# EAGLE design Onion_PCIe_Eval (EAGLE 9.6.2)
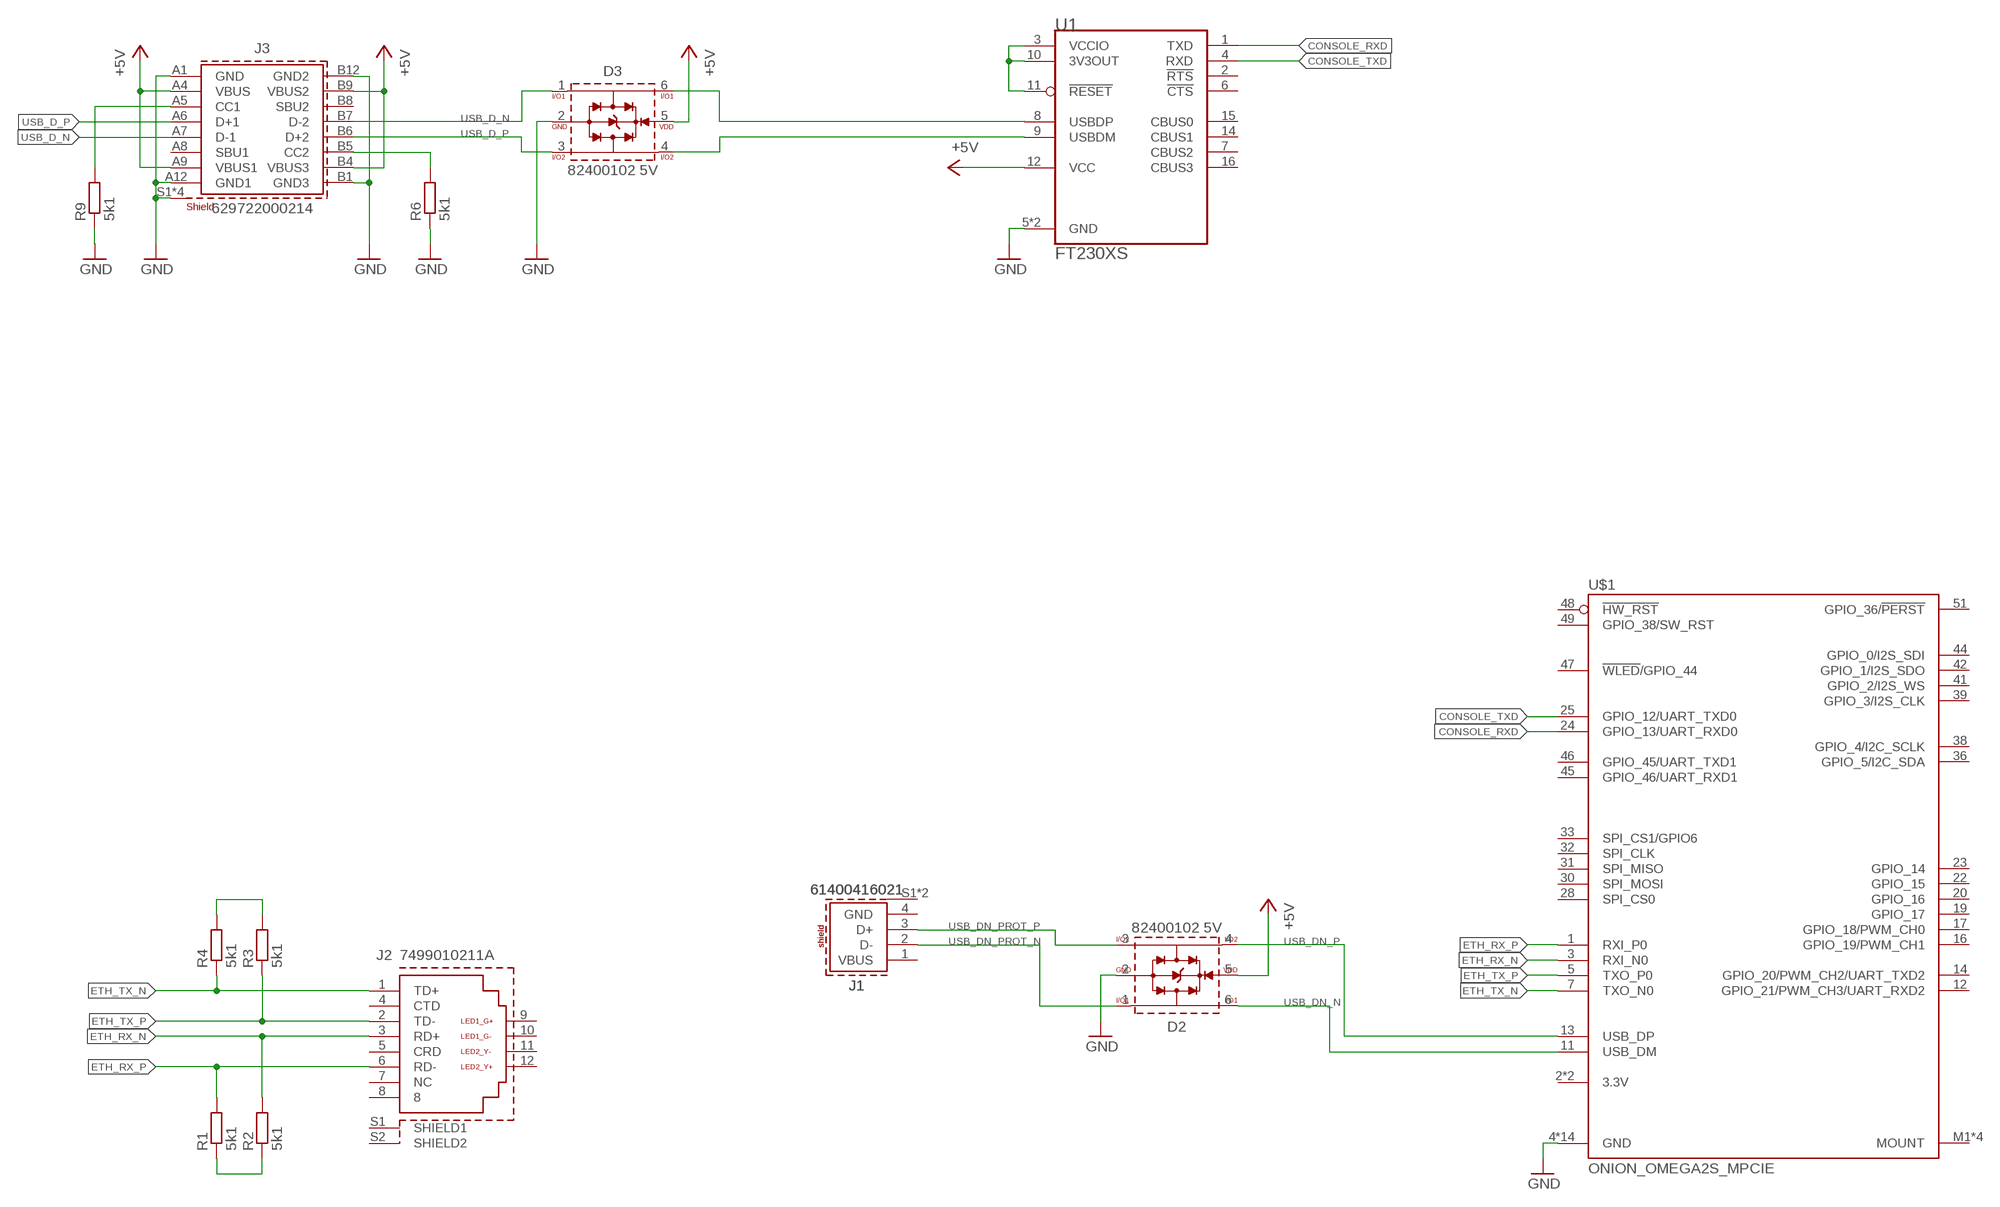
[diagram p0: schematic, sheet 1]

## Parts
D2  82400102 5V  WE-TVS-HS_SOT23-6L_82400102  [WE-TVS_SOT23-6L]
D3  82400102 5V  WE-TVS-HS_SOT23-6L_82400102  [WE-TVS_SOT23-6L]
J1  61400416021  61400416021  [61400416021]
J2  7499010211A  WE-RJ45_7499010211A  [7499010211A]
J3  629722000214  [629722000214]
R1  5k1  R-EU_R0603  [R0603]
R2  5k1  R-EU_R0603  [R0603]
R3  5k1  R-EU_R0603  [R0603]
R4  5k1  R-EU_R0603  [R0603]
R6  5k1  R-EU_R0603  [R0603]
R9  5k1  R-EU_R0603  [R0603]
U1  FT230XS  [SSOP-16_FTD]
U$1  ONION_OMEGA2S_MPCIE  [MINI_PCIE_CONNECTOR_5.2H]

## Nets
+5V: D2.5(VDD) D3.5(VDD) J3.A4(VBUS) J3.A9(VBUS1) J3.B4(VBUS3) J3.B9(VBUS2) U1.12(VCC)
CONSOLE_RXD: U1.1(TXD) U$1.24(GPIO_13/UART_RXD0)
CONSOLE_TXD: U1.4(RXD) U$1.25(GPIO_12/UART_TXD0)
ETH_RX_N: J2.3(RD+) R2.2 U$1.3(RXI_N0)
ETH_RX_P: J2.6(RD-) R1.2 U$1.1(RXI_P0)
ETH_TX_N: J2.1(TD+) R4.1 U$1.7(TXO_N0)
ETH_TX_P: J2.2(TD-) R3.1 U$1.5(TXO_P0)
GND: D2.2(GND) D3.2(GND) J3.A1(GND) J3.A12(GND1) J3.B1(GND3) J3.B12(GND2) J3.S1(SHIELD) J3.S2(SHIELD) J3.S3(SHIELD) J3.S4(SHIELD) R6.1 R9.1 U1.5(GND) U1.13(GND) U$1.4(GND) U$1.9(GND) U$1.15(GND) U$1.18(GND) U$1.21(GND) U$1.26(GND) U$1.27(GND) U$1.29(GND) U$1.34(GND) U$1.35(GND) U$1.37(GND) U$1.40(GND) U$1.43(GND) U$1.50(GND)
N$1: R1.1 R2.1
N$2: J3.A5(CC1) R9.2
N$3: R3.2 R4.2
N$4: U1.3(VCCIO) U1.10(3V3OUT) U1.11(!RESET)
N$5: J3.B5(CC2) R6.2
USB_D_N [USB]: D3.1(I/O1) J3.A7(D-1) J3.B7(D-2)
USB_D_P [USB]: D3.3(I/O2) J3.A6(D+1) J3.B6(D+2)
USB_D_PROT_N [USB]: D3.6(I/O3) U1.8(USBDP)
USB_D_PROT_P [USB]: D3.4(I/O4) U1.9(USBDM)
USB_DN_N: D2.6(I/O3) U$1.11(USB_DM)
USB_DN_P: D2.4(I/O4) U$1.13(USB_DP)
USB_DN_PROT_N: D2.1(I/O1) J1.2(D-)
USB_DN_PROT_P [USB]: D2.3(I/O2) J1.3(D+)
Unconnected: J1.1(VBUS) J1.4(GND) J1.S1(SHIELD) J1.S2(SHIELD) J2.4(CTD) J2.5(CRD) J2.7(NC) J2.8 J2.9(LED1_G+) J2.10(LED1_G-) J2.11(LED2_Y-) J2.12(LED2_Y+) J2.S1(SHIELD1) J2.S2(SHIELD2) J3.A8(SBU1) J3.B8(SBU2) U1.2(!RTS) U1.6(!CTS) U1.7(CBUS2) U1.14(CBUS1) U1.15(CBUS0) U1.16(CBUS3) U$1.2(3.3V) U$1.12(GPIO_21/PWM_CH3/UART_RXD2) U$1.14(GPIO_20/PWM_CH2/UART_TXD2) U$1.16(GPIO_19/PWM_CH1) U$1.17(GPIO_18/PWM_CH0) U$1.19(GPIO_17) U$1.20(GPIO_16) U$1.22(GPIO_15) U$1.23(GPIO_14) U$1.28(SPI_CS0) U$1.30(SPI_MOSI) U$1.31(SPI_MISO) U$1.32(SPI_CLK) U$1.33(SPI_CS1/GPIO6) U$1.36(GPIO_5/I2C_SDA) U$1.38(GPIO_4/I2C_SCLK) U$1.39(GPIO_3/I2S_CLK) U$1.41(GPIO_2/I2S_WS) U$1.42(GPIO_1/I2S_SDO) U$1.44(GPIO_0/I2S_SDI) U$1.45(GPIO_46/UART_RXD1) U$1.46(GPIO_45/UART_TXD1) U$1.47(!WLED!/GPIO_44) U$1.48(!HW_RST) U$1.49(GPIO_38/SW_RST) U$1.51(GPIO_36/!PERST) U$1.52(3.3V) U$1.M1(MOUNT) U$1.M2(MOUNT) U$1.M3(MOUNT) U$1.M4(MOUNT)

## Library data of the parts
D2 D3 = Wurth_EMC Components_WE-TVS:WE-TVS-HS_SOT23-6L_82400102: WE-TVS TVS Diode – High Speed Series Characteristics Low clamping voltage Sturdy design Very low capacitance Flow Thru Design for a simple layout Rail to Rail protection Epoxy flame resistant UL94-V0 RoHS, REACH and free of halogens Applications Very fast data lines USB 2.0 Ethernet PoE VGA Sim Cards Keypads HS = High Speed <https://www.we-online.com/catalog/media/o14883v209%20Family_WE-TVS_HIGHSPEED.jpg> Details see: https://www.we-online.com/catalog/en/WE-TVS-HS Updated by Ella Wu 2021-12-16 2021(C) Wurth Elektronik; C-CH: 2pF; CHANNELS: 2+1; DATASHEET-URL: https://www.we-online.com/catalog/datasheet/82400102.pdf; IPEAK: 7A; MOUNT: SMT; PART-NUMBER: 82400102; VALUE: 5Vdc; VBR: 6V
J1 = Wurth_Connectors_WR-USB:61400416021: WR-COM USB 2.0 Type A Horizontal Kind Properties Durability:1 500 Mating cycles Quality Class:1 500 Mating cycles Connector Type:USB Gender:Receptacle Type:Horizontal General Information Operating Temperature:-40up to +105 °C Compliance:RoHS Electrical Properties IR 1:1.5 A Working Voltage:30V (AC) Withstanding Voltage:750 V (AC) Contact Resistance:20 mΩ Material Properties Insulator Material:PBT Insulator Flammability Rating:UL94 V-0 Color:White Cover Material:Brass Cover Plating:Nickel Contact Material:Copper Alloy Contact Plating:Selective Gold Contact Type:Stamped Shielding Material:Brass Shielding Plating:Nickel <https://www.we-online.com/catalog/media/o32983v209%20Family_WR-COM_61400416021.jpg> Details see: https://www.we-online.com/catalog/en/COM_TYPE_A_HORIZONTAL/ Updated by Yingchun, Shan 2020-01-14 2020 (C) Würth Elektronik; APPLICATION: USB 2.0; DATASHEET-URL: https://www.we-online.com/redexpert/spec/61400416021?ae; GERDER: Receptacle; INTERFACE-TYPE: Type A; IR: 1.5A; MOUNT: THT; PACKAGING: Tray; PART-NUMBER: 61400416021; PINS: 4; TYPE: Horizontal; WORKING-VOLTAGE: 30V(AC)
J2 = Wurth_Signal & Communications_WE-RJ45_LAN:WE-RJ45_7499010211A: WE-RJ45 LAN Transformer Characteristics RJ45 Connector with integrated transformer / common mode choke Power over Ethernet up to 50 Watt and speeds up to 10 Gbit/s Available in SMD, THT and THT with USB Compliant with standards: IEEE 802.3u, IEEE 802.3ab, IEEE 802.3af, IEEE 802.3at, IEEE 802.3an and upcoming IEE 802.3bt Applications Suitable for industrial temperatures from –40 °C up to +85 °C Compatible to Industrial Ethernet systems like EtherCAT or Profinet Compliant with most IC’s for Ethernet applications such as Microchip, Texas Instruments, Broadcom, Linear Technology Hubs, Routers, Switches, IP cameras, IoT applications <https://www.we-online.com/components/media/o35731v209%20Family-WE-RJ45LAN-7499xxxxxx.jpg> Details see: www.we-online.com/components/products/WE-LAN-RJ45 <www.we-online.com/catalog/WE-LAN-RJ45/?utm_source=eagle_model&utm_medium=description_link&utm_campaign=eisos_eagle> Updated by Ella Wu 2023-08-16 2023 (C) Wurth Elektronik; DATA-RATE: 10/100 Base-T; DATASHEET-URL: https://www.we-online.com/redexpert/spec/7499010211A?ae; LED: green-yellow; MOUNT: THT; PART-NUMBER: 7499010211A; POE: non-PoE; PORTS: 1; USB: No
J3 = Wurth_Connectors_WR-USB:629722000214: WR-COM USB 2.0 Type C Receptacle Horizontal SMT Kind Properties Durability 10 000 Mating cycles Gender Receptacle Type Horizontal General Information Operating Temperature -40 up to +85 °C Electrical Properties Working Voltage 20 V (DC) Withstanding Voltage 100 V (AC) Contact Resistance 40 mΩ Material Properties Insulator Material LCP Insulator Flammability Rating UL94 V-0 Insulator Color Black Contact Material Brass Contact Plating Gold over Nickel Contact Type Stamped Shielding Material Steel Shielding Plating Nickel (Ni) <https://www.we-online.com/components/media/o689297v209%20family-wr-com-629722000214.jpg> Details see: www.we-online.com/en/components/products/WR-COM_USB_20_TYPE_C_RECEPTACLE_HORIZONTAL_SMT <www.we-online.com/catalog/WR-COM_USB_20_TYPE_C_RECEPTACLE_HORIZONTAL_SMT/?utm_source=eagle_model&utm_medium=description_link&utm_campaign=eisos_eagle> Updated by Ella Wu 2023-05-30 2023 (C) Würth Elektronik; APPLICATION: USB 2.0; DATASHEET-URL: https://www.we-online.com/redexpert/spec/629722000214?ae; GERDER: Receptacle; INTERFACE-TYPE: Type C; IR: 5A; MOUNT: SMT; PACKAGING: Tape and Reel; PART-NUMBER: 629722000214; PINS: 16; TYPE: Horizontal; WORKING-VOLTAGE: 20V(AC)
R1-R4 R6 R9 = rcl:R-EU_: RESISTOR, European symbol; SPICEPREFIX: R
U1 = Eigene-Rietig:FT230XS; COPYRIGHT: Copyright (C) 2024 Ultra Librarian. All rights reserved.; MANUFACTURER_PART_NUMBER: FT230XS; MFR_NAME: FTDI, Future Technology Devices International Ltd
U$1 = Eigene-Rietig:ONION_OMEGA2S_MPCIE

## Net classes
1 USB: clearance 0.5 mm to class 0

## Board
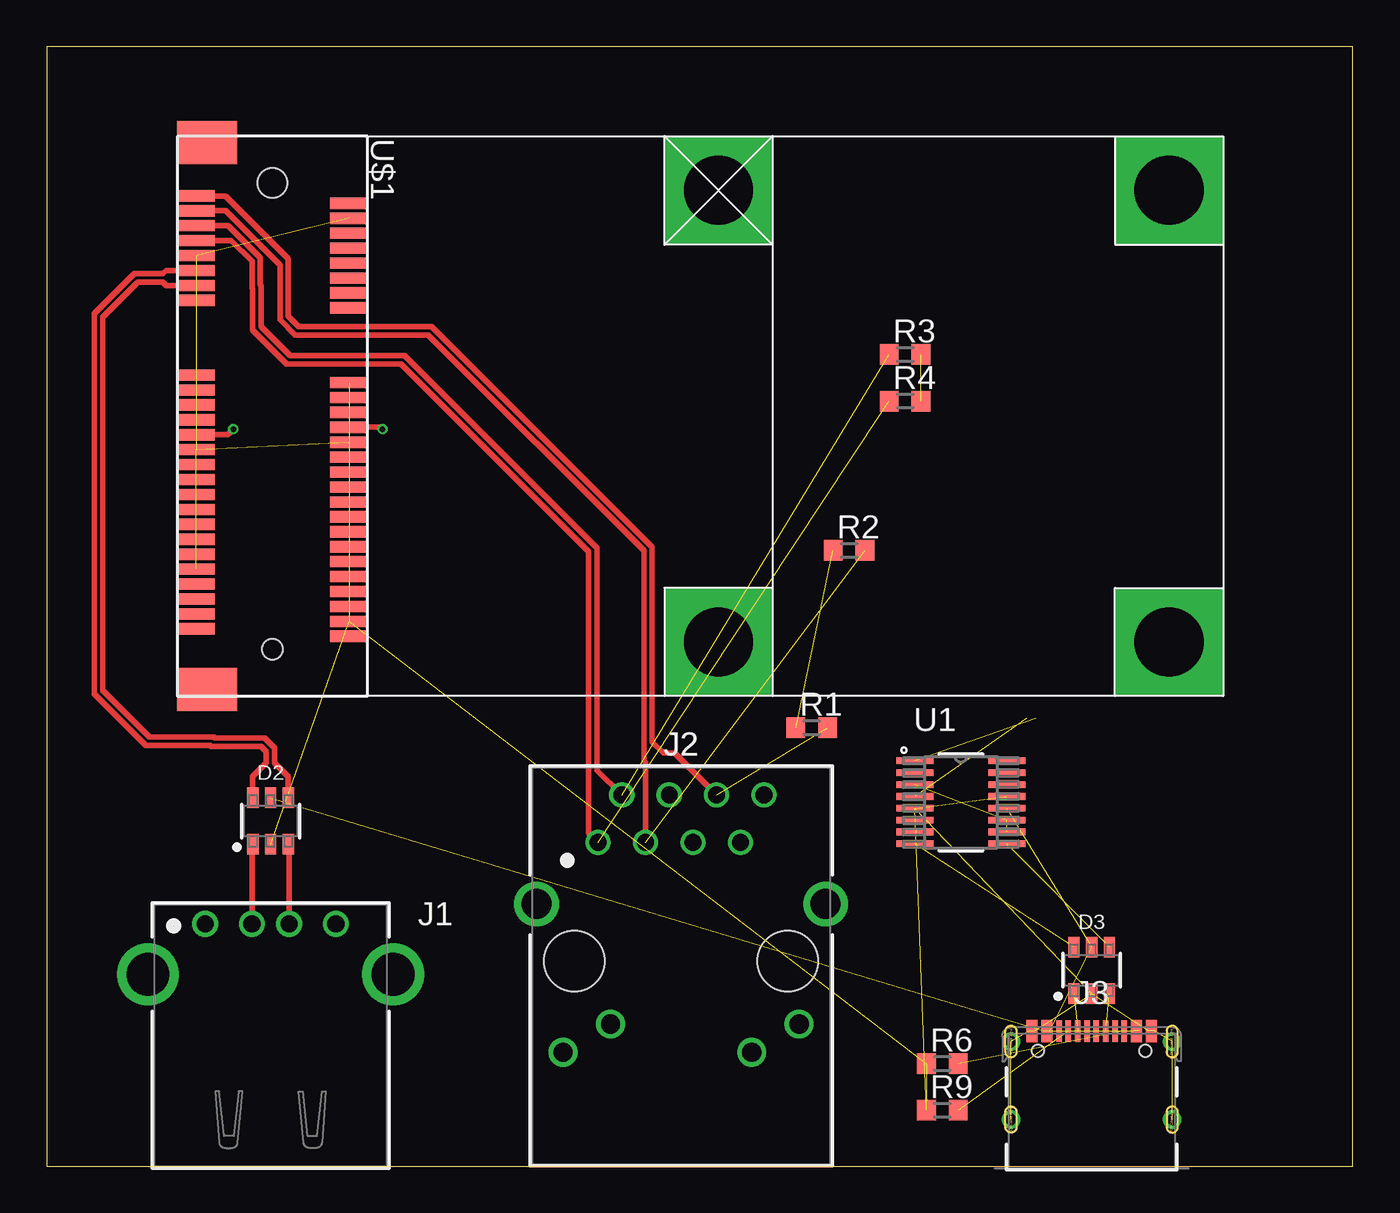
[diagram p1: board, top side]
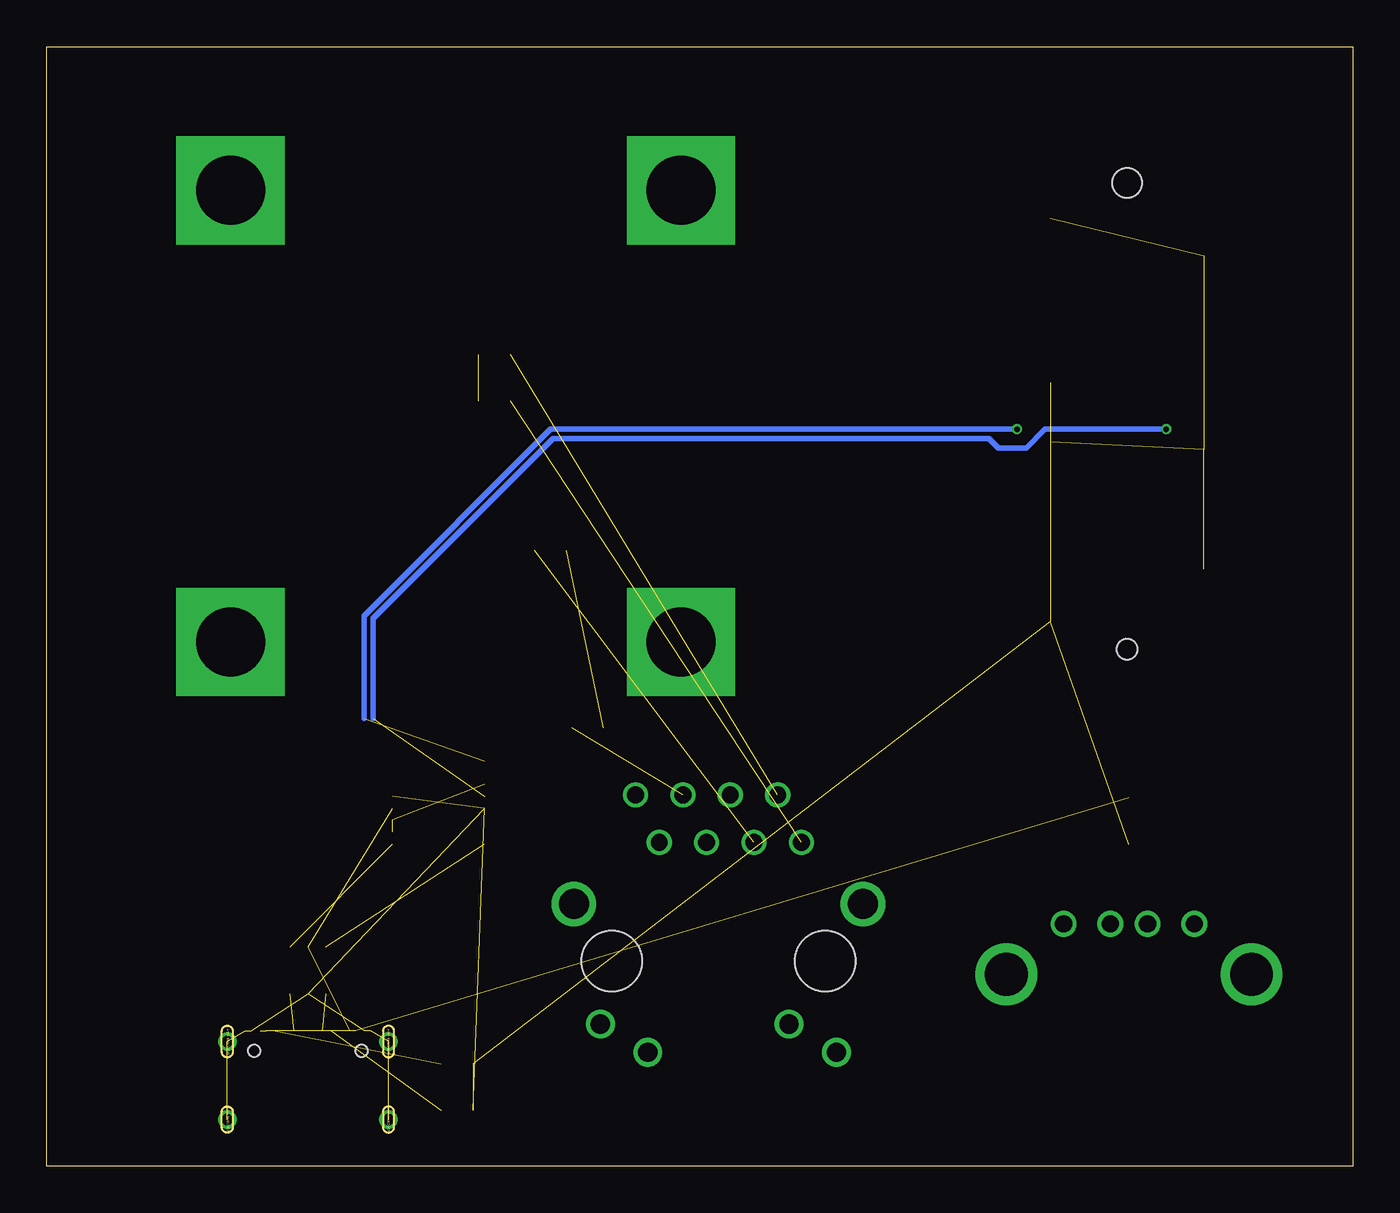
[diagram p2: board, bottom side, seen from below]

Size 70 x 60 mm. Coordinates in mm from the lower left corner, seen from the top.
Outline: 0,0 70,0 70,60 0,60 0,0
Copper layers (1+2*15+16): Top 0.035mm / dielectric 0.2mm / GND 0.0175mm / dielectric 1.065mm / Route15 0.0175mm / dielectric 0.2mm / Bottom 0.035mm
Design rules "jlcpcb-4layers_seb": minimum track width 0.1mm, minimum drill 0.2mm, track to track 0.1mm, track to pad 0.1mm, pad to pad 0.1mm, via to via 0.1mm, smd to smd 0mil, copper to edge 0.2mm, drill to drill 8mil, minimum pad ring 0.125mm, minimum via ring 0.11mm, stop-mask expansion 2mil, vias tented up to drill 20mil, thermal gap 10mil

### Footprints (pad centres in the part's own frame; a part is rotated, then mirrored left to right if it is on the bottom)
WE-TVS_SOT23-6L = smd 0.6 x 1.1: 1 -0.95,-1.25; 2 0,-1.25; 3 0.95,-1.25; 4 0.95,1.25; 5 0,1.25; 6 -0.95,1.25
61400416021 = drill 0.92: 1 -3.5,5.99; 2 -1,5.99; 3 1,5.99; 4 3.5,5.99 | drill 2.3: S1 -6.57,3.28; S2 6.57,3.28
7499010211A = drill 0.9: 1 -4.445,6.35; 2 -3.175,8.89; 3 -1.905,6.35; 4 -0.635,8.89; 5 0.635,6.35; 6 1.905,8.89; 7 3.175,6.35; 8 4.445,8.89 | drill 1.03: 9 -6.325,-4.9; 10 -3.785,-3.38; 11 3.785,-4.9; 12 6.325,-3.38 | drill 1.6: S1 -7.745,3.05; S2 7.745,3.05 | hole 3.25: -5.715,0; 5.715,0
629722000214 = smd 0.3 x 1.15: A1 -3.35,4.745; A4 -2.55,4.745; A5 -1.25,4.745; A6 -0.25,4.745; A7 0.25,4.745; A8 1.25,4.745; A9 2.55,4.745; A12 3.35,4.745; B1 3.05,4.745; B4 2.25,4.745; B5 1.75,4.745; B6 0.75,4.745; B7 -0.75,4.745; B8 -1.75,4.745; B9 -2.25,4.745; B12 -3.05,4.745 | drill 0.6 pad 1: S1 -4.32,4.18; S2 4.32,4.18; S3 -4.32,0; S4 4.32,0 | hole 0.65: -2.89,3.68; 2.89,3.68
R0603 = smd 1 x 1.1: 1 -0.85,0; 2 0.85,0
SSOP-16_FTD = smd 1.981 x 0.356: 1 -2.464,2.223; 2 -2.464,1.587; 3 -2.464,0.953; 4 -2.464,0.318; 5 -2.464,-0.318; 6 -2.464,-0.953; 7 -2.464,-1.587; 8 -2.464,-2.223; 9 2.464,-2.223; 10 2.464,-1.587; 11 2.464,-0.953; 12 2.464,-0.318; 13 2.464,0.318; 14 2.464,0.953; 15 2.464,1.587; 16 2.464,2.223
MINI_PCIE_CONNECTOR_5.2H = smd 0.6 x 2: 1 0,0; 2 0.4,8.2; 3 0.8,0; 4 1.2,8.2; 5 1.6,0; 6 2,8.2; 7 2.4,0; 8 2.8,8.2; 9 3.2,0; 10 3.6,8.2; 11 4,0; 12 4.4,8.2; 13 4.8,-0.005; 14 5.2,8.2; 15 5.6,0; 16 6,8.2; 17 9.6,0; 18 10,8.2; 19 10.4,0; 20 10.8,8.2; 21 11.2,0; 22 11.6,8.2; 23 12,-0.005; 24 12.4,8.2; 25 12.8,0; 26 13.2,8.2; 27 13.6,0; 28 14,8.2; 29 14.4,0; 30 14.8,8.2; 31 15.2,0; 32 15.6,8.2; 33 16,0; 34 16.4,8.2; 35 16.8,0; 36 17.2,8.2; 37 17.6,0; 38 18,8.2; 39 18.4,0; 40 18.8,8.2; 41 19.2,0; 42 19.6,8.2; 43 20,0; 44 20.4,8.2; 45 20.8,0; 46 21.2,8.2; 47 21.6,0; 48 22,8.2; 49 22.4,0; 50 22.8,8.2; 51 23.2,0; 52 23.6,8.2 | smd 2.3 x 3.2: 53 26.45,0.6; 55 -2.85,0.6 | drill 3.7 pad 5.8 square: M1 -0.3,28; M2 23.9,28; M3 -0.3,52.15; M4 23.9,52.15 | hole 1.6: -0.7,4.1 | hole 1.1: 24.3,4.1

### Placement (x,y rotation side)
D2  12,18.5 0 top
D3  56,10.5 0 top
J1  12,7 0 top
J2  34,11 0 top
J3  56,2.5 0 top
R1  41,23.5 0 top
R2  43,33 0 top
R3  46,43.5 0 top
R4  46,41 0 top
R6  48,5.5 0 top
R9  48,3 0 top
U1  49,19.5 0 top
U$1  8,52 270 top

### Tracks (layer width: path | path; a pad name or v marks a point on that pad's centre or on a via)
+5V  (6 unrouted)
CONSOLE_RXD  (via drill 0.3)  (1 unrouted)
  Top 0.3: U$1.24 17.9,39.6 v18,39.5
  Bottom 0.3: v18,39.5 43,39.5 53,29.5 53,24
CONSOLE_TXD  (via drill 0.3)  (1 unrouted)
  Top 0.3: U$1.25 9.7,39.2 v10,39.5
  Bottom 0.3: v10,39.5 16.5,39.5 17.5,38.5 19,38.5 19.5,39 42.86,39 52.5,29.36 52.5,24
ETH_RX_N  (1 unrouted)
  Top 0.3: U$1.3 9.6,51.2 12.5,48.3 12.5,45.36 13.31,44.55 20.45,44.55 32,33 32,23.8 | 32,23.8 | 32,23.8 32,21.75 32.09,21.65 J2.3
ETH_RX_P  (1 unrouted)
  Top 0.3: U$1.1 9.6,52 12.95,48.65 12.95,45.55 13.5,45 20.64,45 32.45,33.19 32.45,25 | 32.45,25 | 32.45,25 32.45,22.74 33.05,22.14 33.65,22.14 J2.6
ETH_TX_N  (1 unrouted)
  Top 0.3: J2.1 29.05,17.86 29.05,32.95 19,43 12.86,43 11.05,44.81 11.05,47 11,47.05 11,48.5 9.9,49.6 U$1.7
ETH_TX_P  (1 unrouted)
  Top 0.3: J2.2 29.5,21.21 29.5,33.14 19.19,43.45 13.05,43.45 11.5,45 11.5,47.19 11.45,47.23 11.45,48.69 9.74,50.4 U$1.5
GND  (27 unrouted)
N$1  (1 unrouted)
N$2  (1 unrouted)
N$3  (1 unrouted)
N$4  (2 unrouted)
N$5  (1 unrouted)
USB_D_N  (2 unrouted)
USB_D_P  (2 unrouted)
USB_D_PROT_N  (1 unrouted)
USB_D_PROT_P  (1 unrouted)
USB_DN_N
  Top 0.3: U$1.11 6.4,48 6.23,47.83 4.69,47.83 2.55,45.69 2.55,25.31 5.31,22.55 8.77,22.55 8.81,22.5 11.5,22.5 11.77,22.23 11.77,21.62 11.05,20.9 D2.6
USB_DN_P
  Top 0.3: U$1.13 6.39,47.2 6.22,47.37 4.87,47.37 3,45.5 3,25.5 5.5,23 8.95,23 9,22.95 11.69,22.95 12.23,22.41 12.23,21.62 12.95,20.9 D2.4
USB_DN_PROT_N
  Top 0.3: J1.2 11,17.2 D2.1
USB_DN_PROT_P
  Top 0.3: J1.3 13,17.2 D2.3